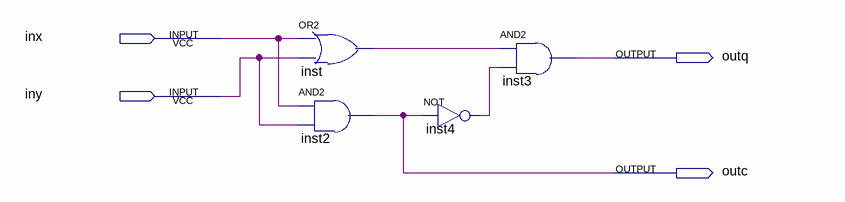
[diagram p0: schematic sheet]
// Quartus schematic LC1_Prishechepa.bdf as structural Verilog: 4 symbols, 4 pins
module LC1_Prishechepa (
  input  inx,
  input  iny,
  output outq,
  output outc
);

  wire inst4_out, inst_out;

  or inst (inst_out, inx, iny);
  and inst2 (outc, inx, iny);
  not inst4 (inst4_out, outc);
  and inst3 (outq, inst_out, inst4_out);
endmodule
